# Altium project SolarNode.PrjPCB
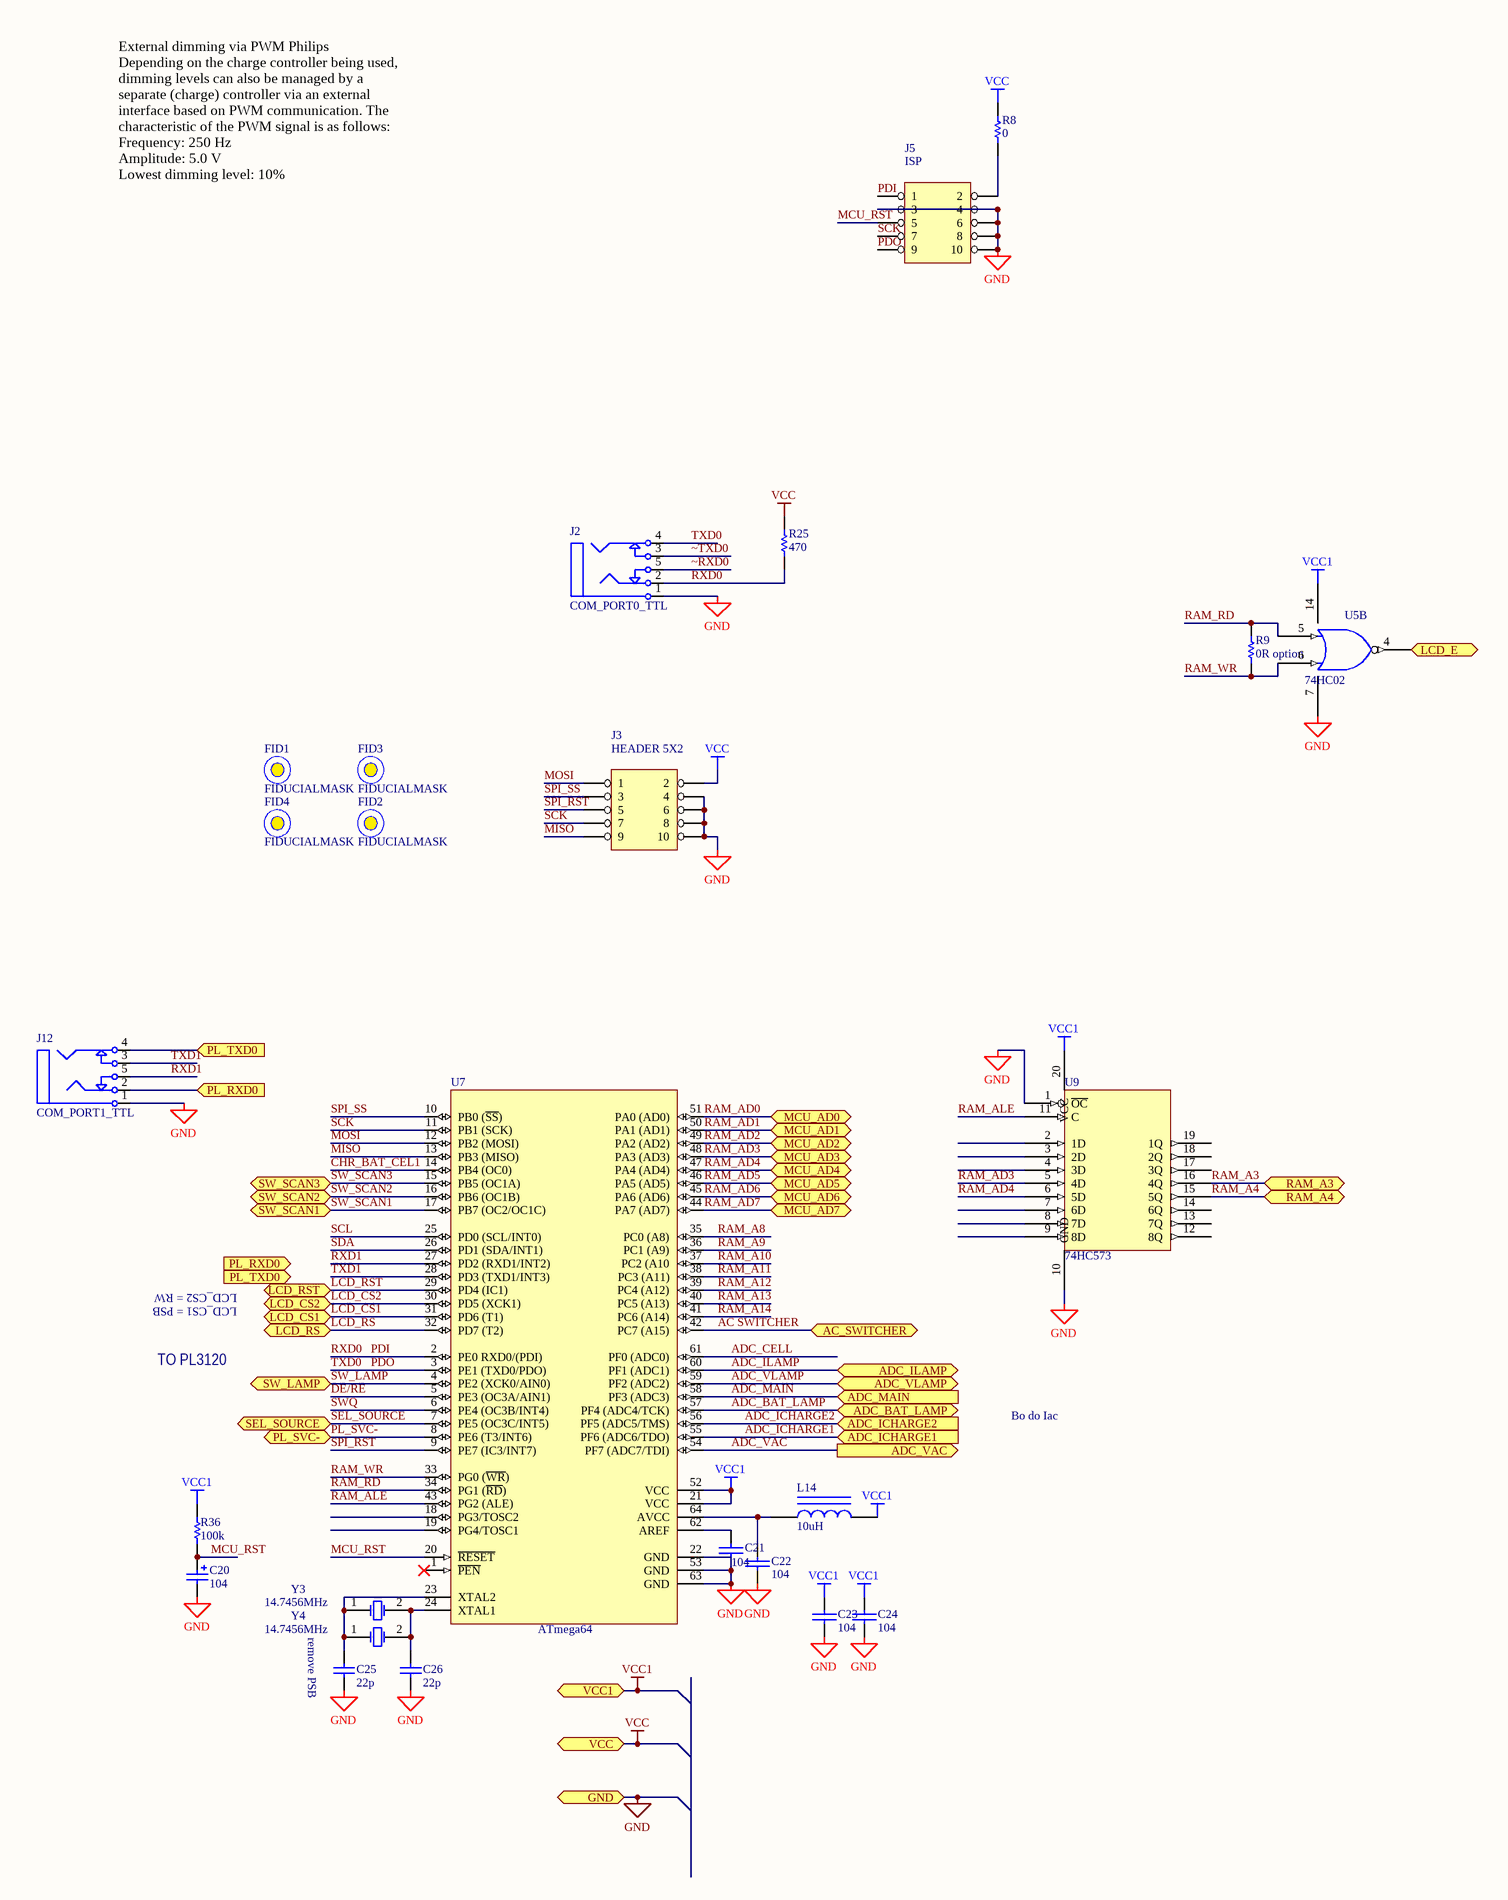
[diagram p0: Mcu.SchDoc, left]
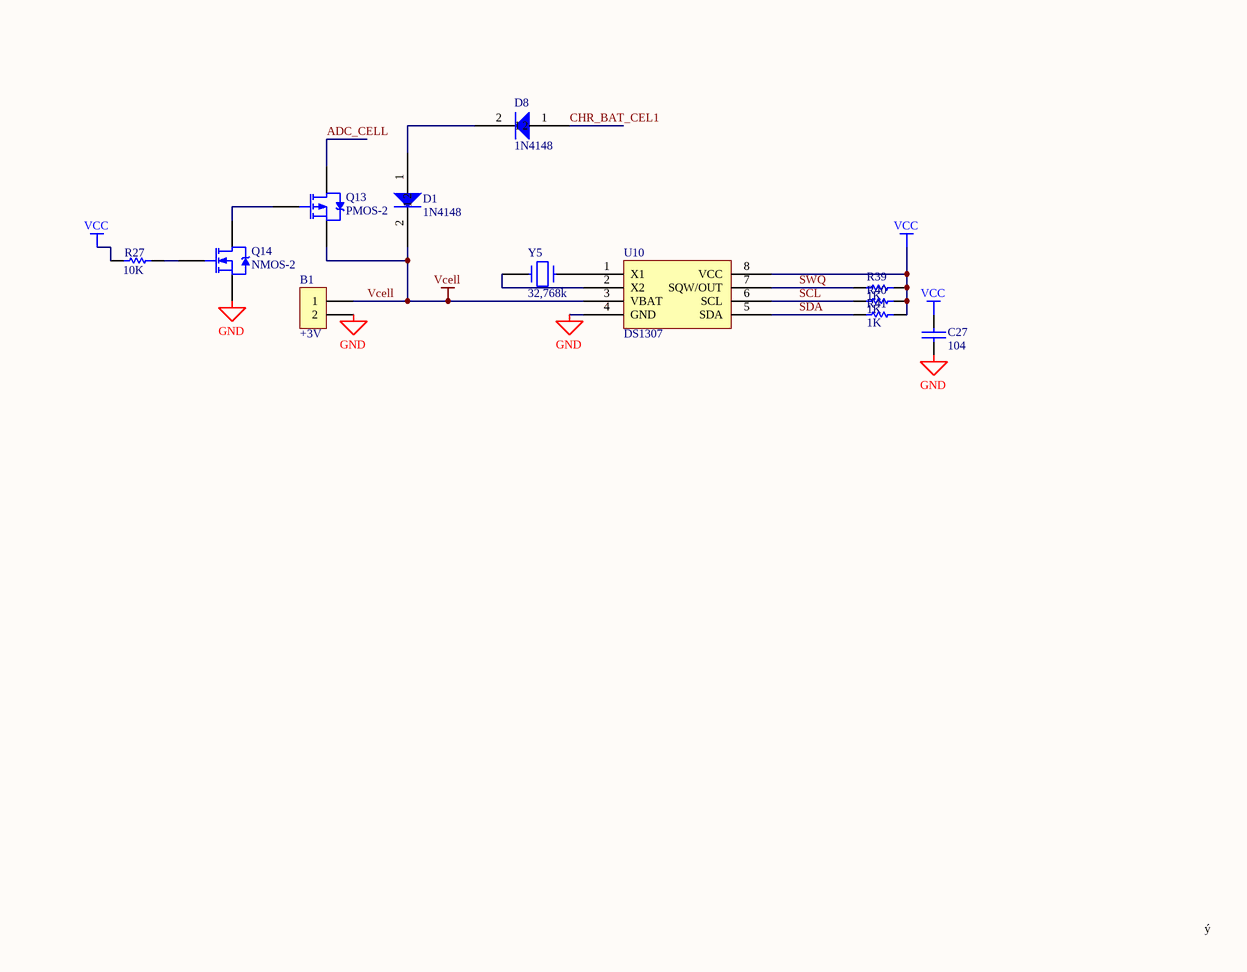
[diagram p1: Mcu.SchDoc, right]
5 sheets, 172 parts. Net scope: flat (ports and power ports of the same name join across sheets).
Board file: SolarNode.PcbDoc
Sheets:
  Mcu.SchDoc
  HUD.SchDoc
  PLmodule.SchDoc
  Actuator.SchDoc
  ACmonitor.SchDoc

## Sheet Mcu.SchDoc
size A2

### Parts
B1  +3V  [NI-MH-3V6]
C20  104  [C6-0805_N]
C21  104  [C6-0805_N]
C22  104  [C6-0805_N]
C23  104  [C6-0805_N]
C24  104  [C6-0805_N]
C25  22p  [C6-0805_N]
C26  22p  [C6-0805_N]
C27  104  [C6-0805_N]
D1  1N4148  [SOD80, LL-34]
D8  1N4148  [SOD80, LL-34]
FID1  FIDUCIALMASK  [FIDUCIALMASK]
FID2  FIDUCIALMASK  [FIDUCIALMASK]
FID3  FIDUCIALMASK  [FIDUCIALMASK]
FID4  FIDUCIALMASK  [FIDUCIALMASK]
J2  COM_PORT0_TTL  [SJ-3515]
J3  HEADER 5X2  [10P_PCB_HEADER_BRD_MNT]
J5  ISP  [10P_PCB_HEADER_BRD_MNT]
J12  COM_PORT1_TTL  [SJ-3515]
L14  10uH  [R6-0805_N]
Q13  PMOS-2  [SOT23-3]
Q14  NMOS-2  [SOT23-3]
R8  0  [JP2]
R9  0R option  [6-0805_N]
R25  470  [6-0805_N]
R27  10K  [6-0805_N]
R36  100k  [6-0805_N]
R39  1K  [6-0805_N]
R40  1K  [6-0805_N]
R41  1K  [6-0805_N]
U5  74HC02  [SOIC127P600X175-14AN]  (part B of 4)
U7  ATmega64  [QFP64-3]
U9  74HC573  [SOIC127P1041-20L]
U10  DS1307  [M08A_N]
Y3  14.7456MHz  [XTAL]
Y4  14.7456MHz  [CRYSTAL_HC49-US-SM]
Y5  32,768k  [R38]

### Ports
AC_SWITCHER, ADC_BAT_LAMP, ADC_ICHARGE1, ADC_ICHARGE2, ADC_ILAMP, ADC_MAIN, ADC_VAC, ADC_VLAMP, GND, LCD_CS1, LCD_CS2, LCD_E, LCD_RS, LCD_RST, MCU_AD0, MCU_AD1, MCU_AD2, MCU_AD3, MCU_AD4, MCU_AD5, MCU_AD6, MCU_AD7, PL_RXD0, PL_SVC-, PL_TXD0, RAM_A3, RAM_A4, SEL_SOURCE, SW_LAMP, SW_SCAN1, SW_SCAN2, SW_SCAN3, VCC, VCC1

### Nets
GND: B1.2 C20.2 C21.2 C22.1 C23.2 C24.2 C25.1 C26.1 C27.2 J2.1 J3.4 J3.6 J3.8 J3.10 J5.3 J5.4 J5.6 J5.8 J5.10 J12.1 Q14.2(S) U5.7(GND) U7.22(GND) U7.53(GND) U7.63(GND) U9.1(~{OC}) U9.10(GND) U10.4(GND) ; port GND
VCC: C27.1 J3.2 R8.1 R25.1 R27.2 R39.2 R40.2 R41.2 U10.8(VCC) ; port VCC
VCC1: C23.1 C24.1 L14.1 R36.2 U5.14(VCC) U7.21(VCC) U7.52(VCC) U9.20(VCC) ; port VCC1
Vcell: B1.1 D1.2 Q13.2(S) U10.3(VBAT)
AC SWITCHER: U7.42(PC7_(A15)) ; port AC_SWITCHER
ADC_BAT_LAMP: U7.57(PF4_(ADC4/TCK)) ; port ADC_BAT_LAMP
ADC_CELL: Q13.3(D) U7.61(PF0_(ADC0))
ADC_ICHARGE1: U7.55(PF6_(ADC6/TDO)) ; port ADC_ICHARGE1
ADC_ICHARGE2: U7.56(PF5_(ADC5/TMS)) ; port ADC_ICHARGE2
ADC_ILAMP: U7.60(PF1_(ADC1)) ; port ADC_ILAMP
ADC_MAIN: U7.58(PF3_(ADC3)) ; port ADC_MAIN
ADC_VAC: U7.54(PF7_(ADC7/TDI)) ; port ADC_VAC
ADC_VLAMP: U7.59(PF2_(ADC2)) ; port ADC_VLAMP
CHR_BAT_CEL1: D8.1 U7.14(PB4_(OC0))
DE/RE: U7.5(PE3_(OC3A/AIN1))
E: U5.4 ; port LCD_E
IO_8: J12.4 ; port PL_TXD0
IO_10: J12.2 ; port PL_RXD0
LCD_CS1: U7.31(PD6_(T1)) ; port LCD_CS1
LCD_CS2: U7.30(PD5_(XCK1)) ; port LCD_CS2
LCD_RS: U7.32(PD7_(T2)) ; port LCD_RS
LCD_RST: U7.29(PD4_(IC1)) ; port LCD_RST
MCU_RST: C20.1 J5.5 R36.1 U7.20(~{RESET})
MISO: J3.9 U7.13(PB3_(MISO))
MOSI: J3.1 U7.12(PB2_(MOSI))
PDI: J2.2 J5.1 R25.2 U7.2(PE0_RXD0/(PDI))  [also labelled RXD0]
PDO: J2.4 J5.9 U7.3(PE1_(TXD0/PDO))  [also labelled TXD0]
PL_SVC-: U7.8(PE6_(T3/INT6)) ; port PL_SVC-
RAM_A3: U9.16(4Q) ; port RAM_A3
RAM_A4: U9.15(5Q) ; port RAM_A4
RAM_A8: U7.35(PC0_(A8))
RAM_A9: U7.36(PC1_(A9))
RAM_A10: U7.37(PC2_(A10)
RAM_A11: U7.38(PC3_(A11))
RAM_A12: U7.39(PC4_(A12))
RAM_A13: U7.40(PC5_(A13))
RAM_A14: U7.41(PC6_(A14))
RAM_AD0: U7.51(PA0_(AD0)) ; port MCU_AD0  [project net DB0]
RAM_AD1: U7.50(PA1_(AD1)) ; port MCU_AD1  [project net DB1]
RAM_AD2: U7.49(PA2_(AD2)) ; port MCU_AD2  [project net DB2]
RAM_AD3: U7.48(PA3_(AD3)) U9.5(4D) ; port MCU_AD3  [project net DB3]
RAM_AD4: U7.47(PA4_(AD4)) U9.6(5D) ; port MCU_AD4  [project net DB4]
RAM_AD5: U7.46(PA5_(AD5)) ; port MCU_AD5  [project net DB5]
RAM_AD6: U7.45(PA6_(AD6)) ; port MCU_AD6  [project net DB6]
RAM_AD7: U7.44(PA7_(AD7)) ; port MCU_AD7  [project net DB7]
RAM_ALE: U7.43(PG2_(ALE)) U9.11(C)
RAM_RD: R9.1 U5.5 U7.34(PG1_(~{RD}))
RAM_WR: R9.2 U5.6 U7.33(PG0_(~{WR}))
RXD1: J12.5 U7.27(PD2_(RXD1/INT2))
SCK: J3.7 J5.7 U7.11(PB1_(SCK))
SCL: R40.1 U7.25(PD0_(SCL/INT0)) U10.6(SCL)
SDA: R41.1 U7.26(PD1_(SDA/INT1)) U10.5(SDA)
SEL_SOURCE: U7.7(PE5_(OC3C/INT5)) ; port SEL_SOURCE
SPI_RST: J3.5 U7.9(PE7_(IC3/INT7))
SPI_SS: J3.3 U7.10(PB0_(~{SS}))
SW_LAMP: U7.4(PE2_(XCK0/AIN0)) ; port SW_LAMP
SW_SCAN1: U7.17(PB7_(OC2/OC1C)) ; port SW_SCAN1
SW_SCAN2: U7.16(PB6_(OC1B)) ; port SW_SCAN2
SW_SCAN3: U7.15(PB5_(OC1A)) ; port SW_SCAN3
SWQ: R39.1 U7.6(PE4_(OC3B/INT4)) U10.7(SQW/OUT)
TXD1: J12.3 U7.28(PD3_(TXD1/INT3))
~RXD0: J2.5
~TXD0: J2.3
NetC21_1: C21.1 U7.62(AREF)
NetC22_2: C22.2 L14.2 U7.64(AVCC)
NetC25_2: C25.2 U7.23(XTAL2) Y3.1(OSC1) Y4.1(OSC1)
NetC26_2: C26.2 U7.24(XTAL1) Y3.2(OSC2) Y4.2(OSC2)
NetD1_1: D1.1 D8.2
NetJ5_2: J5.2 R8.2
NetQ13_1: Q13.1(G) Q14.3(D)
NetQ14_1: Q14.1(G) R27.1
NetU10_1: U10.1(X1) Y5.1
NetU10_2: U10.2(X2) Y5.2

Not connected (* = marked no-connect by the designer): J2 1A 1B 2A 2B 3A 3B 4A 4B 5A 5B; J12 1A 1B 2A 2B 3A 3B 4A 4B 5A 5B; U7 1(~{PEN})* 18(PG3/TOSC2) 19(PG4/TOSC1); U9 2(1D) 3(2D) 4(3D) 7(6D) 8(7D) 9(8D) 12(8Q) 13(7Q) 14(6Q) 17(3Q) 18(2Q) 19(1Q)

### Notes on the sheet
- External dimming via PWM Philips
  Depending on the charge controller being used, dimming levels can also be managed by a
  separate (charge) controller via an external interface based on PWM communication. The
  characteristic of the PWM signal is as follows:
  Frequency: 250 Hz
  Amplitude: 5.0 V
  Lowest dimming level: 10%
- LCD_CS1 = PSB
- LCD_CS2 = RW
- TO PL3120
- Bo do Iac
- (near C25) remove PSB
- ý

### Library data of the parts
B1 = CON2: Ni-Mh 3v6 chargable
C20 = Cap Pol1: Polarized Capacitor (Radial); Published: *; LatestRevisionDate: *; LatestRevisionNote: *; PackageReference: *; Publisher: *; Value: *
C21-C24 C27 = CAP: Capacitor
C25 C26 = Cap: Capacitor; Value: 22 pF; Published: 8-Jun-2000; LatestRevisionDate: 17-Jul-2002; LatestRevisionNote: Re-released for DXP Platform.; PackageReference: RAD-0.3; Publisher: Altium Limited
D1 D8 = DIODE: pin to pad: 1>A 2>K
J2 J12 = Phonejack Stereo SW: 3-Conductor Jack with 2 break contacts (normals) and 2 auxiliary make contacts; Published: 5-Jan-2004; LatestRevisionDate: 17-Dec-2003; LatestRevisionNote: PCB Footprint replaced.; DatasheetDocument: 07-Mar-2000; Publisher: Altium Limited; ComponentLink1Description: Manufacturer Link; ComponentLink1URL: http://domino.kycon.com/internet/Products.html
J5 = HEADER 5X2
L14 = INDUCTOR IRON: 80 Ohm SMD-0805 Chip Ferrite Bead
Q13 = PMOS-2: P Mosfet transistor, input Logic level, Fast switching, 12V - 750mA; Note: Pin 4 not drawn and electrically connected to Pin 2.; Published: 8-Jun-2000; LatestRevisionDate: 17-Jul-2002; LatestRevisionNote: Re-released for DXP Platform.; DatasheetVersion: PD-9.390D; PackageVersion: Feb-1997; PackageReference: TO-220AB; Publisher: Altium Limited; PackageDescription: TO, Thru-Hole, Vertical, Heatsink Mounted; 3 In-Line Leads; Pitch 2.54 mm; ComponentLink1Description: Manufacturer Link; ComponentLink1URL: http://www.irf.com/
Q14 = NMOS-2: N-Channel Power MOSFET; Note: Pin 2 is electrically connected to pin 4.; Published: 8-Jun-2000; LatestRevisionDate: 17-Jul-2002; LatestRevisionNote: Re-released for DXP Platform.; DatasheetVersion: PD-9.814; PackageVersion: Feb-1997; PackageReference: TO-220AB; Publisher: Altium Limited; PackageDescription: TO, Thru-Hole, Vertical, Heatsink Mounted; 3 In-Line Leads; Pitch 2.54 mm; ComponentLink1Description: Manufacturer Link; ComponentLink1URL: http://www.irf.com/
R8 R9 R25 R27 R36 R39-R41 = Res Semi: Semiconductor Resistor; Published: *; LatestRevisionDate: *; LatestRevisionNote: *; PackageReference: *; Publisher: *; Value: *
U5 = 74LS02
U7 = ATmega64-16AC: 8-Bit AVR Microcontroller with 64K Bytes of In-System Programmable Flash Memory; Published: 17-Sep-2003; LatestRevisionDate: 13-Apr-2006; LatestRevisionNote: IPC-7351 Footprint Added.; DatasheetVersion: 2490C-AVR-009/02; PackageVersion: revB, Oct-2001; PackageReference: 64A; Publisher: Altium Limited; PackageDescription: 64-Pin Thin Quad Flat Pack 0.8 mm Pitch; Code_JEDEC: MS-026-AEB; ComponentLink1Description: Manufacturer Link; ComponentLink1URL: http://www.atmel.com; ComponentLink2Description: Datasheet; ComponentLink2URL: http://www.atmel.com/dyn/resources/prod_documents/doc2490.pdf
Y3 Y4 = XTAL: Crystal Oscillator; Published: 8-Jun-2000; LatestRevisionDate: 17-Jul-2002; LatestRevisionNote: Re-released for DXP Platform.; PackageReference: R38; Publisher: Altium Limited
Y5 = CRYSTAL

## Sheet HUD.SchDoc
size A4
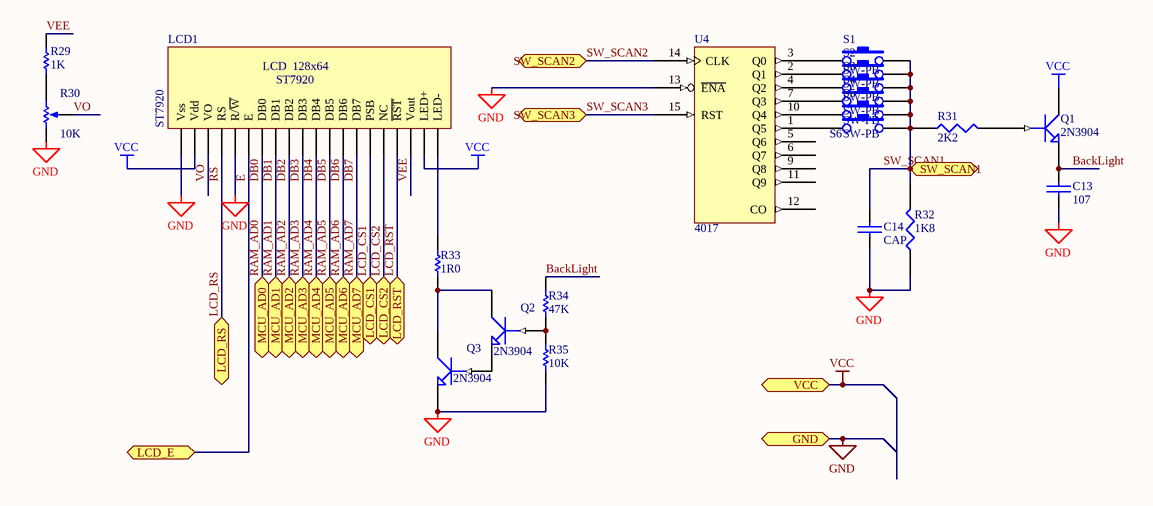
[diagram p2: HUD.SchDoc]

### Parts
C13  107  [SMC_D/WA]
C14  CAP  [6-0805_N]
LCD1  ST7920  [LCD12864B]
Q1  2N3904  [SOT-23]
Q2  2N3904  [SOT-23]
Q3  2N3904  [SOT-23]
R29  1K  [6-0805_N]
R30  10K  [BTXANH]
R31  2K2  [6-0805_N]
R32  1K8  [6-0805_N]
R33  1R0  [6-0805_N]
R34  47K  [6-0805_N]
R35  10K  [6-0805_N]
S1  SW-PB  [CTCHIP_TO]
S2  SW-PB  [CTCHIP_TO]
S3  SW-PB  [CTCHIP_TO]
S4  SW-PB  [CTCHIP_TO]
S5  SW-PB  [CTCHIP_TO]
S6  SW-PB  [CTCHIP_TO]
U4  4017  [SO16]

### Ports
GND, LCD_CS1, LCD_CS2, LCD_E, LCD_RS, LCD_RST, MCU_AD0, MCU_AD1, MCU_AD2, MCU_AD3, MCU_AD4, MCU_AD5, MCU_AD6, MCU_AD7, SW_SCAN1, SW_SCAN2, SW_SCAN3, VCC

### Nets
GND: C13.2 C14.2 LCD1.1(Vss) LCD1.5(R/~{W}) Q3.2(E) R30.1(TOP) R32.1 R35.1 U4.8(GND) U4.13(~{ENA}) ; port GND
VCC: LCD1.2(Vdd) LCD1.19(LED+) Q1.3(C) U4.16(VCC) ; port VCC
BackLight: C13.1 Q1.2(E) R34.2
DB0: LCD1.7(DB0) ; port MCU_AD0  [also labelled RAM_AD0]
DB1: LCD1.8(DB1) ; port MCU_AD1  [also labelled RAM_AD1]
DB2: LCD1.9(DB2) ; port MCU_AD2  [also labelled RAM_AD2]
DB3: LCD1.10(DB3) ; port MCU_AD3  [also labelled RAM_AD3]
DB4: LCD1.11(DB4) ; port MCU_AD4  [also labelled RAM_AD4]
DB5: LCD1.12(DB5) ; port MCU_AD5  [also labelled RAM_AD5]
DB6: LCD1.13(DB6) ; port MCU_AD6  [also labelled RAM_AD6]
DB7: LCD1.14(DB7) ; port MCU_AD7  [also labelled RAM_AD7]
E: LCD1.6(E) ; port LCD_E
LCD_CS1: LCD1.15(PSB) ; port LCD_CS1
LCD_CS2: LCD1.16(NC) ; port LCD_CS2
LCD_RS: LCD1.4(RS) ; port LCD_RS  [also labelled RS]
LCD_RST: LCD1.17(~{RST}) ; port LCD_RST
SW_SCAN1: C14.1 R31.1 R32.2 S1.2 S2.2 S3.2 S4.2 S5.2 S6.2 ; port SW_SCAN1
SW_SCAN2: U4.14(CLK) ; port SW_SCAN2
SW_SCAN3: U4.15(RST) ; port SW_SCAN3
VEE: LCD1.18(Vout) R29.2
VO: LCD1.3(VO) R30.2(TAP)
NetLCD1_20: LCD1.20(LED-) R33.2
NetQ1_1: Q1.1(B) R31.2
NetQ2_1: Q2.1(B) R34.1 R35.2
NetQ2_2: Q2.2(E) Q3.1(B)
NetQ2_3: Q2.3(C) Q3.3(C) R33.1
NetR29_1: R29.1 R30.3(BOT)
NetS1_1: S1.1 U4.3(Q0)
NetS2_1: S2.1 U4.2(Q1)
NetS3_1: S3.1 U4.4(Q2)
NetS4_1: S4.1 U4.7(Q3)
NetS5_1: S5.1 U4.10(Q4)
NetS6_1: S6.1 U4.1(Q5)

Not connected (* = marked no-connect by the designer): U4 5(Q6) 6(Q7) 9(Q8) 11(Q9) 12(CO)

### Notes on the sheet
- (in symbol ST7920) LCD  128x64

### Library data of the parts
C13 C14 = CAP: Capacitor
LCD1 = ST7920: ST7920 LCD128X64
Q1-Q3 = NPN1: NPN Transistor
R29 = Res Semi: Semiconductor Resistor; Value: 470R; Published: 8-Jun-2000; LatestRevisionDate: 17-Jul-2002; LatestRevisionNote: Re-released for DXP Platform.; PackageReference: AXIAL-0.5; Publisher: Altium Limited
R30 = RPot: Potentiometer; Published: *; LatestRevisionDate: *; LatestRevisionNote: *; PackageReference: *; Publisher: *; Sim Note: *; Set Position: *; Value: *
R31 R32 = RES1
R33 = Res Semi: Semiconductor Resistor; Value: 10R; Published: 8-Jun-2000; LatestRevisionDate: 17-Jul-2002; LatestRevisionNote: Re-released for DXP Platform.; PackageReference: AXIAL-0.5; Publisher: Altium Limited
R34 = Res Semi: Semiconductor Resistor; Value: 2K2; Published: 8-Jun-2000; LatestRevisionDate: 17-Jul-2002; LatestRevisionNote: Re-released for DXP Platform.; PackageReference: AXIAL-0.5; Publisher: Altium Limited
R35 = Res Semi: Semiconductor Resistor; Published: 8-Jun-2000; LatestRevisionDate: 17-Jul-2002; LatestRevisionNote: Re-released for DXP Platform.; PackageReference: AXIAL-0.5; Publisher: Altium Limited; Value: 10K

## Sheet PLmodule.SchDoc
size A4
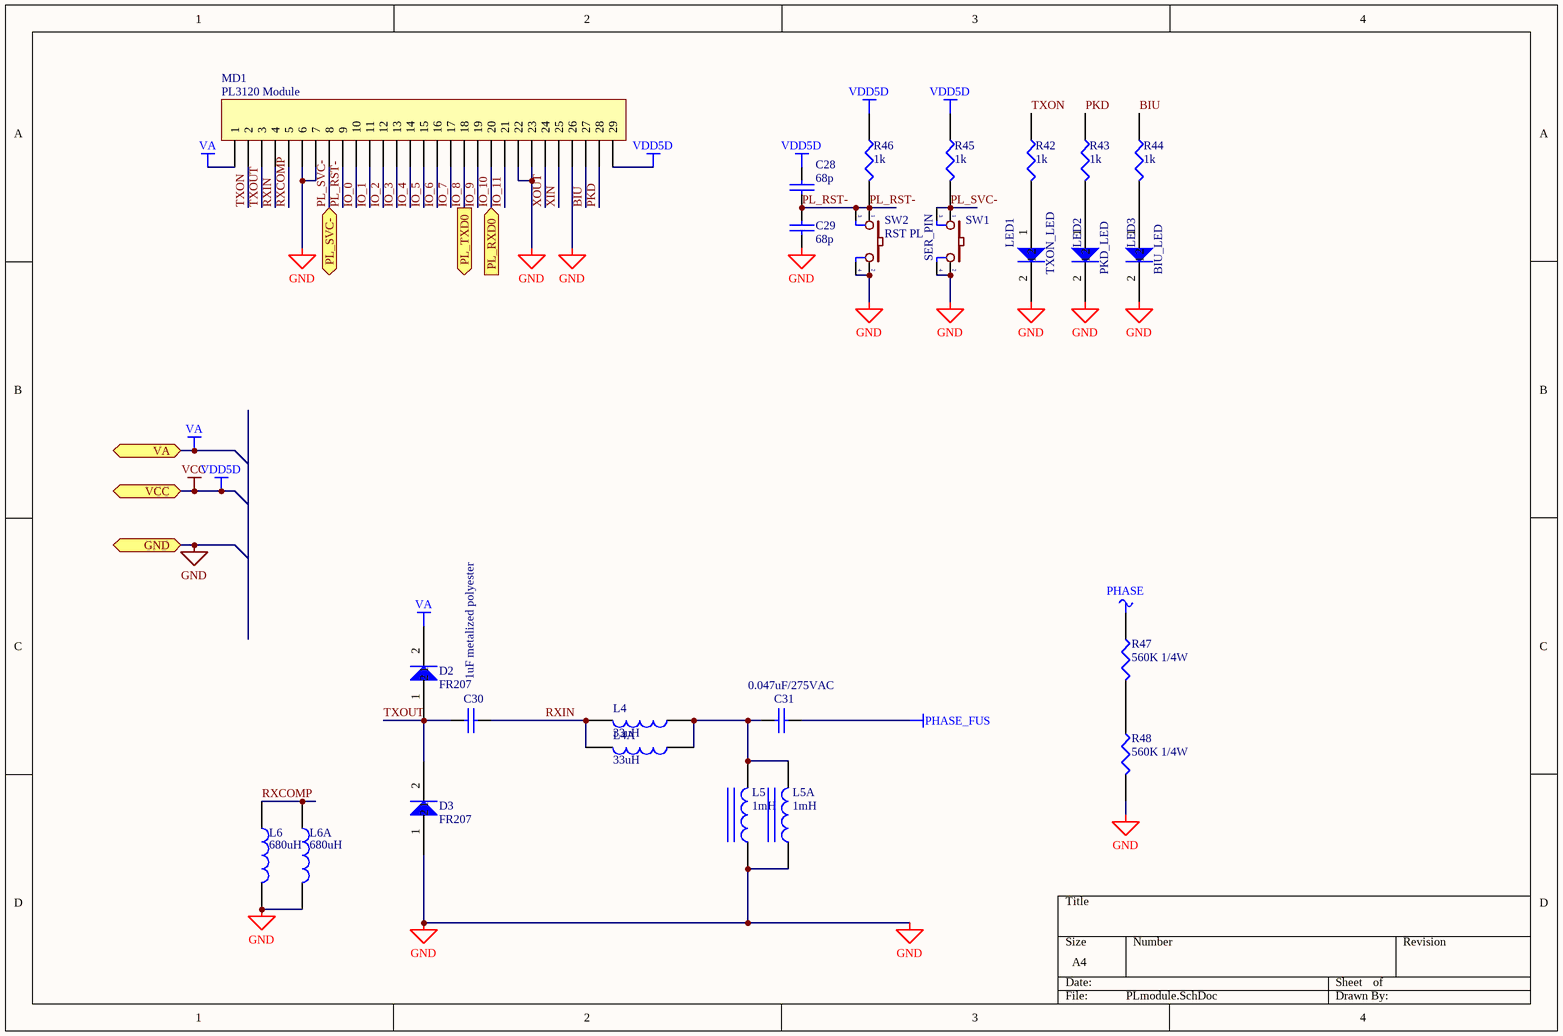
[diagram p3: PLmodule.SchDoc]

### Parts
C28  68p  [C6-0805_N]
C29  68p  [C6-0805_N]
C30  1uF metalized polyester  [CSIP3]
C31  0.047uF/275VAC  [100n400v]
D2  FR207  [DO-214AB]
D3  FR207  [DO-214AB]
L4  33uH  [6D28]
L4A  33uH  [Axial-0.3]
L5  1mH  [6-0805_N]
L5A  1mH  [AXIAL-0.3]
L6  680uH  [6-0805_N]
L6A  680uH  [AXIAL-0.3]
LED1  TXON_LED  [led3mm]
LED2  PKD_LED  [led3mm]
LED3  BIU_LED  [led3mm]
MD1  PL3120 Module  [ECHELONMODULE]
R42  1k  [6-0805_N]
R43  1k  [6-0805_N]
R44  1k  [6-0805_N]
R45  1k  [6-0805_N]
R46  1k  [6-0805_N]
R47  560K 1/4W  [R3216[1206]]
R48  560K 1/4W  [R3216[1206]]
SW1  SER_PIN  [SW-4P-S]
SW2  RST PL  [SW-4P-S]

### Ports
GND, PL_RXD0, PL_SVC-, PL_TXD0, VA, VCC

### Nets
GND: C29.2 D3.1 L5.2 L5A.2 L6.2 L6A.2 LED1.2 LED2.2 LED3.2 MD1.6 MD1.7 MD1.22 MD1.23 MD1.26 R48.1 SW1.2 SW1.4 SW2.2 SW2.4 ; port GND
PHASE: R47.2
PHASE_FUS: C31.1
VA: D2.2 MD1.1 ; port VA
VCC: C28.2 MD1.29 R45.1 R46.1 ; port VCC  [also labelled VDD5D]
BIU: MD1.27 R44.1
IO_0: MD1.10
IO_1: MD1.11
IO_2: MD1.12
IO_3: MD1.13
IO_4: MD1.14
IO_5: MD1.15
IO_6: MD1.16
IO_7: MD1.17
IO_8: MD1.18 ; port PL_TXD0
IO_9: MD1.19
IO_10: MD1.20 ; port PL_RXD0
IO_11: MD1.21
PKD: MD1.28 R43.1
PL_RST-: C28.1 C29.1 MD1.9 R46.2 SW2.1 SW2.3
PL_SVC-: MD1.8 R45.2 SW1.1 SW1.3 ; port PL_SVC-
RXCOMP: L6.1 L6A.1 MD1.5
RXIN: C30.2 L4.1 L4A.1 MD1.4
TXON: MD1.2 R42.1
TXOUT: C30.1 D2.1 D3.2 MD1.3
XIN: MD1.25
XOUT: MD1.24
NetC31_2: C31.2 L4.2 L4A.2 L5.1 L5A.1
NetLED1_1: LED1.1 R42.2
NetLED2_1: LED2.1 R43.2
NetLED3_1: LED3.1 R44.2
NetR47_1: R47.1 R48.2

### Library data of the parts
C28-C30 = CAP: Capacitor
C31 = CAP: X2 0.047uF/275VAC
D2 D3 = DIODE: pin to pad: 1>A 2>K
L4 = INDUCTOR: 0805 inductor
L4A = INDUCTOR: Axial inductor
L5 L5A = INDUCTOR IRON
L6 L6A = INDUCTOR
LED1-LED3 = DIODE
MD1 = CON29: Connector
R42-R48 = RES1
SW1 SW2 = SW4-1: Switch button 4 pin; pin to pad: 3>4 4>3; Value: SW chip 4 pin

## Sheet Actuator.SchDoc
size A3
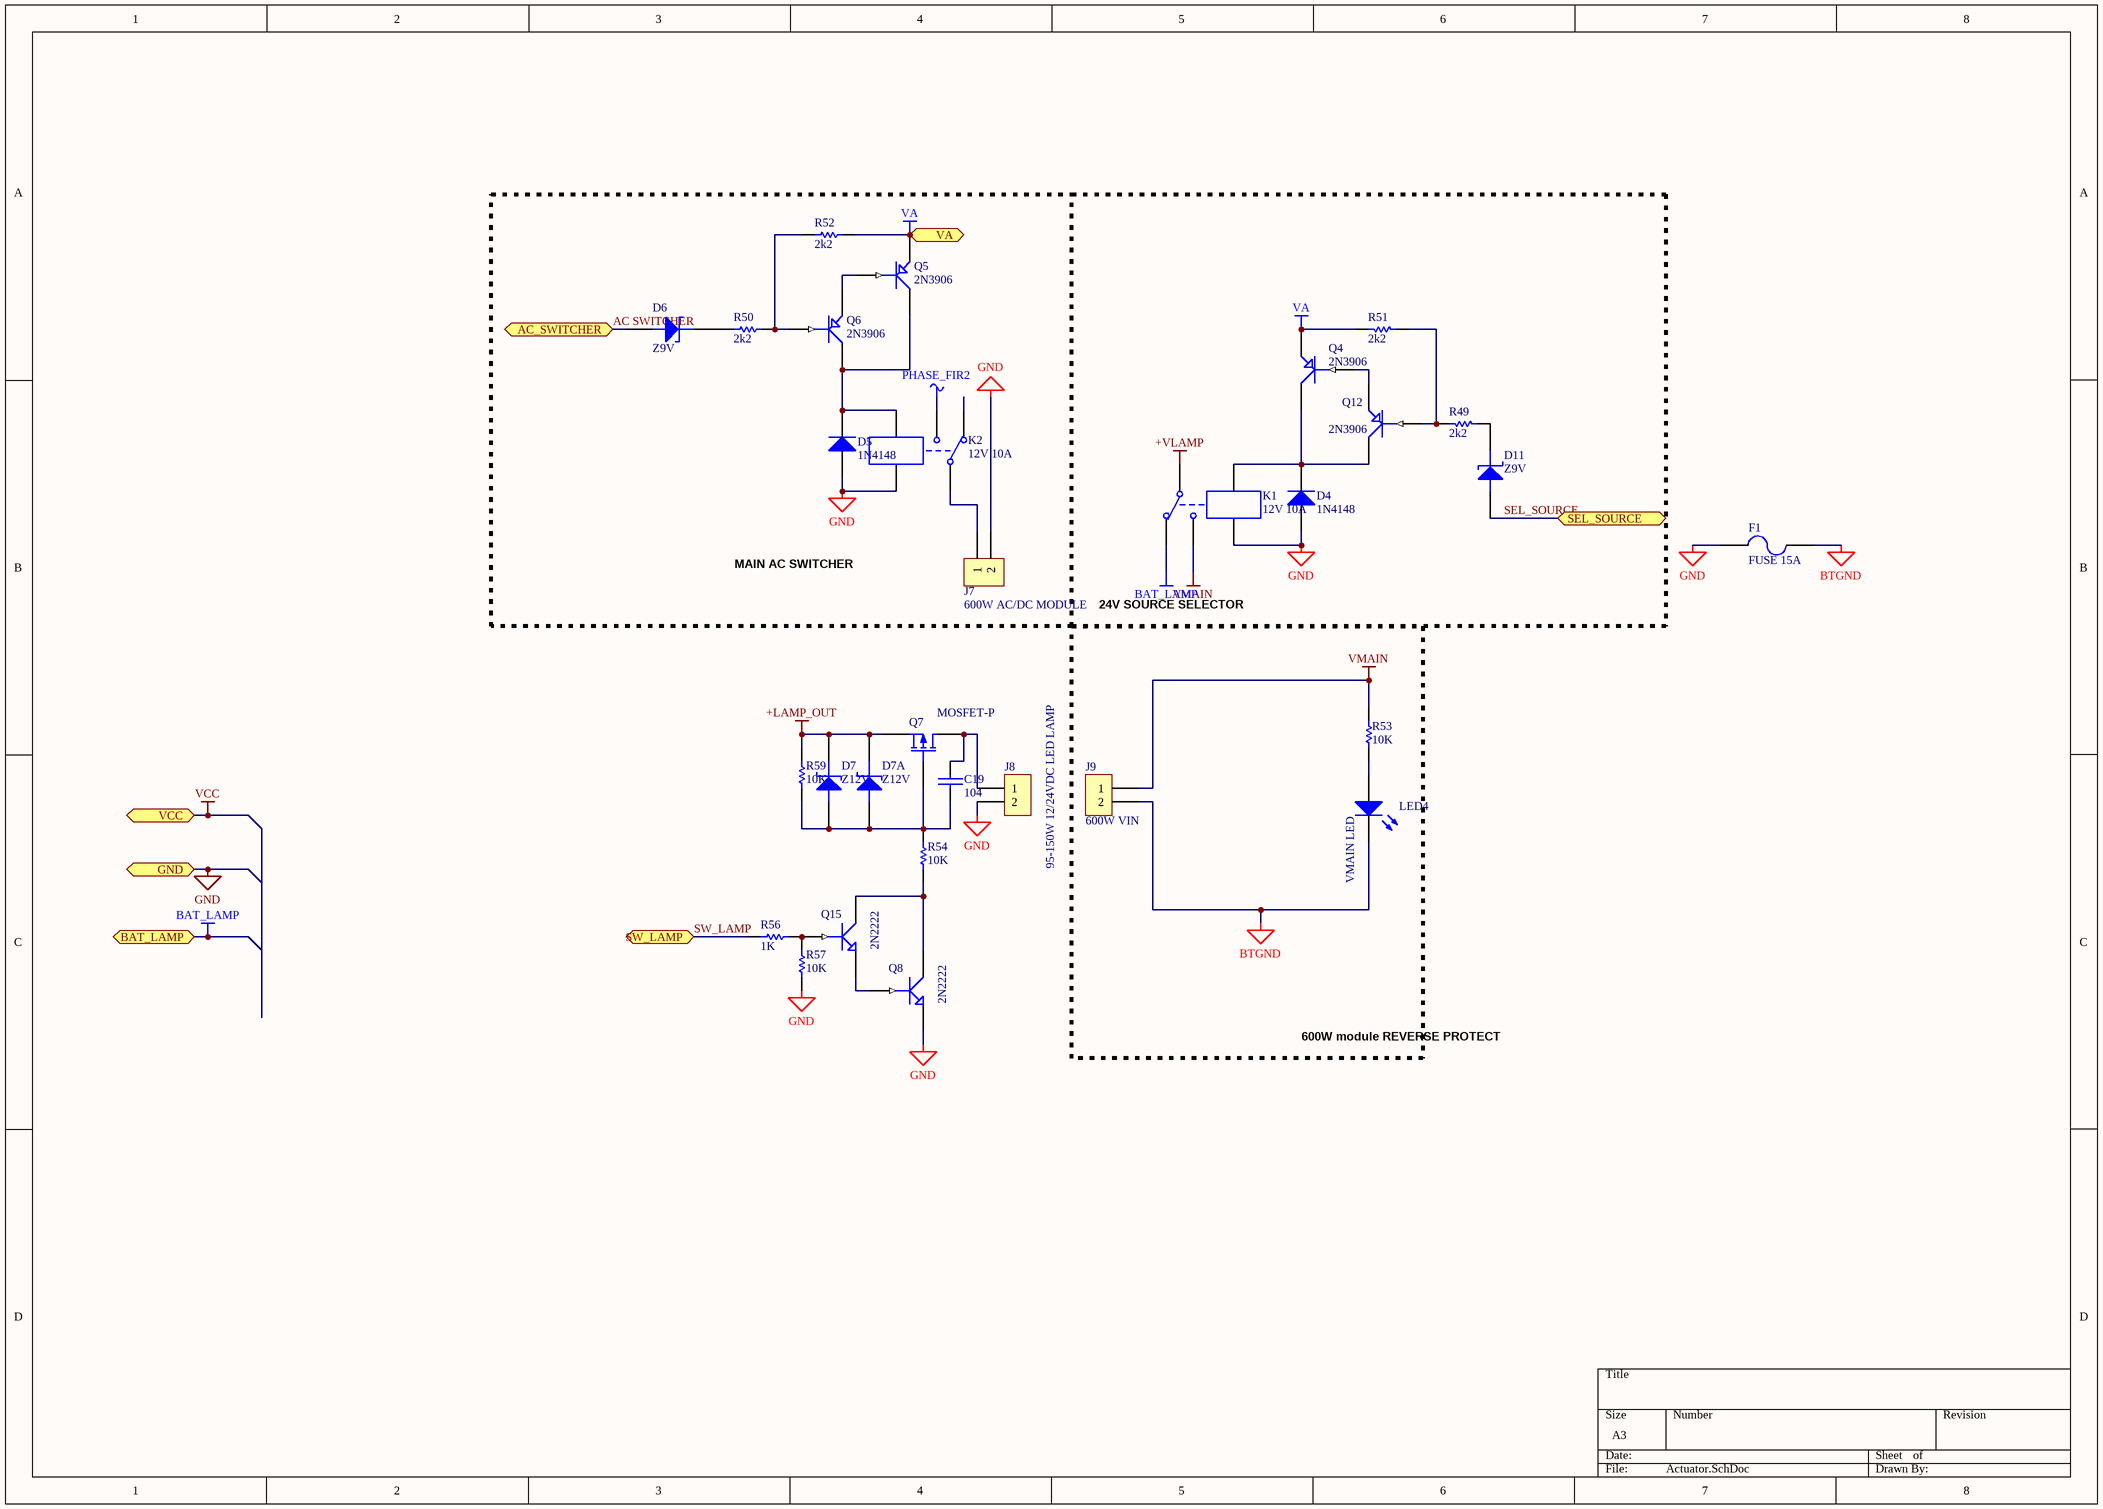
[diagram p4: Actuator.SchDoc]

### Parts
C19  104  [C6-0805_N]
D4  1N4148  [SOD80, LL-34]
D5  1N4148  [SOD80, LL-34]
D6  Z9V  [SOD80, LL-34]
D7  Z12V  [DO-35]
D7A  Z12V  [SOD80, LL-34]
D11  Z9V  [SOD80, LL-34]
F1  FUSE 15A  [FUSE2]
J7  600W AC/DC MODULE  [TERMINAL2]
J8  95-150W 12/24VDC LED LAMP  [TERMINAL2]
J9  600W VIN  [TERMINAL2]
K1  12V 10A  [RELAYVUONG]
K2  12V 10A  [RELAYVUONG]
LED4  VMAIN LED  [led3mm]
Q4  2N3906  [SOT23-3]
Q5  2N3906  [SOT23-3]
Q6  2N3906  [SOT23-3]
Q7  MOSFET-P  [D2PAK-3]
Q8  2N2222  [SOT23-3]
Q12  2N3906  [SOT23-3]
Q15  2N2222  [SOT23-3]
R49  2k2  [6-0805_N]
R50  2k2  [6-0805_N]
R51  2k2  [6-0805_N]
R52  2k2  [6-0805_N]
R53  10K  [6-0805_N]
R54  10K  [6-0805_N]
R56  1K  [6-0805_N]
R57  10K  [6-0805_N]
R59  10K  [6-0805_N]

### Blocks framed on the sheet
24V SOURCE SELECTOR: D4 D11 K1 Q4 Q12 R49 R51

### Ports
AC_SWITCHER, BAT_LAMP, GND, SEL_SOURCE, SW_LAMP, VA, VCC

### Nets
+LAMP_OUT: D7.2(K) D7A.2(K) Q7.3(S) R59.2
+VLAMP: K1.1
BAT_LAMP: K1.2 ; port BAT_LAMP
BTGND: F1.2 J9.2 LED4.2(K)
GND: D4.1(A) D5.1(A) F1.1 J7.2 J8.2 K1.5 K2.4 Q8.2(E) R57.1 ; port GND
PHASE_FIR2: K2.3
VA: Q4.2(E) Q5.2(E) R51.2 R52.2 ; port VA
VMAIN: J9.1 K1.3 R53.2
AC SWITCHER: D6.1(A) ; port AC_SWITCHER
SEL_SOURCE: D11.1(A) ; port SEL_SOURCE
SW_LAMP: R56.1 ; port SW_LAMP
NetC19_1: C19.1 J8.1 Q7.2(D)
NetC19_2: C19.2 D7.1(A) D7A.1(A) Q7.1(G) R54.2 R59.1
NetD4_2: D4.2(K) K1.4 Q4.3(C) Q12.3(C)
NetD5_2: D5.2(K) K2.5 Q5.3(C) Q6.3(C)
NetD6_2: D6.2(K) R50.1
NetD11_2: D11.2(K) R49.1
NetJ7_1: J7.1 K2.1
NetLED4_1: LED4.1(A) R53.1
NetQ4_1: Q4.1(B) Q12.2(E)
NetQ5_1: Q5.1(B) Q6.2(E)
NetQ6_1: Q6.1(B) R50.2 R52.1
NetQ8_1: Q8.1(B) Q15.2(E)
NetQ8_3: Q8.3(C) Q15.3(C) R54.1
NetQ12_1: Q12.1(B) R49.2 R51.1
NetQ15_1: Q15.1(B) R56.2 R57.2

Not connected (* = marked no-connect by the designer): K2 2

### Notes on the sheet
- MAIN AC SWITCHER
- 600W module REVERSE PROTECT

### Library data of the parts
C19 = CAP: Capacitor
D4 D5 = Diode 1N4007: 1 Amp General Purpose Rectifier; pin to pad: 1>A 2>K; Published: 8-Jun-2000; LatestRevisionDate: 17-Jul-2002; LatestRevisionNote: Re-released for DXP Platform.; DatasheetDocument: 1998; PackageDocument: Aug-1999; PackageReference: DO-41; Publisher: Altium Limited; Code_JEDEC: DO-204-AL; ComponentLink1Description: Manufacturer Link; ComponentLink1URL: http://www.fairchildsemi.com/; ComponentLink2Description: Datasheet; ComponentLink2URL: http://www.fairchildsemi.com/ds/1N%2F1N4001.pdf
D6 D7A D11 = ZENER2: Zener Diode; pin to pad: 1>A 2>K
D7 = ZENER2: Zener Diode
F1 = FUSE2: Fuse
J7-J9 = CON2: Connector
K1 K2 = Relay-SPDT: G5LA-10A/250VAC / SRC-12VDC-SL-C; Published: 24-Mar-1999; LatestRevisionDate: 17-Jul-2002; LatestRevisionNote: Re-released for DXP Platform.; PackageReference: MODULE5B; Publisher: Altium Limited
LED4 = LED3: Typical BLUE SiC LED; Published: 8-Jun-2000; LatestRevisionDate: 17-Dec-2003; LatestRevisionNote: PCB Footprint replaced.; DatasheetVersion: 16-Apr-2002; PackageVersion: 16-Apr-2002; PackageReference: 3.5X2.8X1.9; Publisher: Altium Limited; PackageDescription: SM LED; 2 C-Bend Leads; Body 3.5 x 2.8 x 1.9 mm, inc leads (LxWxH typ)
Q4-Q6 Q12 = PNP1: PNP Transistor
Q7 = MOSFET-P: P-Channel MOSFET; pin to pad: 2>4; Published: 8-Jun-2000; LatestRevisionDate: 17-Jul-2002; LatestRevisionNote: Re-released for DXP Platform.; PackageVersion: 1995/1996; PackageReference: E3; Publisher: Altium Limited; PackageDescription: TO, Flat Index; 3 In-Line, Axial Leads; Body Dia. 4.6mm; Lead Dia. 0.5 mm (max)
Q8 Q15 = NPN1: NPN Transistor
R49 R50 R53 R57 = Res Semi: Semiconductor Resistor
  R49 R50: Published: 8-Jun-2000; LatestRevisionDate: 17-Jul-2002; LatestRevisionNote: Re-released for DXP Platform.; PackageReference: AXIAL-0.5; Publisher: Altium Limited; Value: 2K2
  R53: Published: *; LatestRevisionDate: *; LatestRevisionNote: *; PackageReference: *; Publisher: *; Value: *
  R57: Published: 8-Jun-2000; LatestRevisionDate: 17-Jul-2002; LatestRevisionNote: Re-released for DXP Platform.; PackageReference: AXIAL-0.5; Publisher: Altium Limited; Value: 10K
R51 R52 = Res Semi: Semiconductor Resistor; Value: 10K; Published: 8-Jun-2000; LatestRevisionDate: 17-Jul-2002; LatestRevisionNote: Re-released for DXP Platform.; PackageReference: AXIAL-0.5; Publisher: Altium Limited
R54 R56 R59 = Res Semi: Semiconductor Resistor; Value: 2K2; Published: 8-Jun-2000; LatestRevisionDate: 17-Jul-2002; LatestRevisionNote: Re-released for DXP Platform.; PackageReference: AXIAL-0.5; Publisher: Altium Limited

## Sheet ACmonitor.SchDoc
size A3
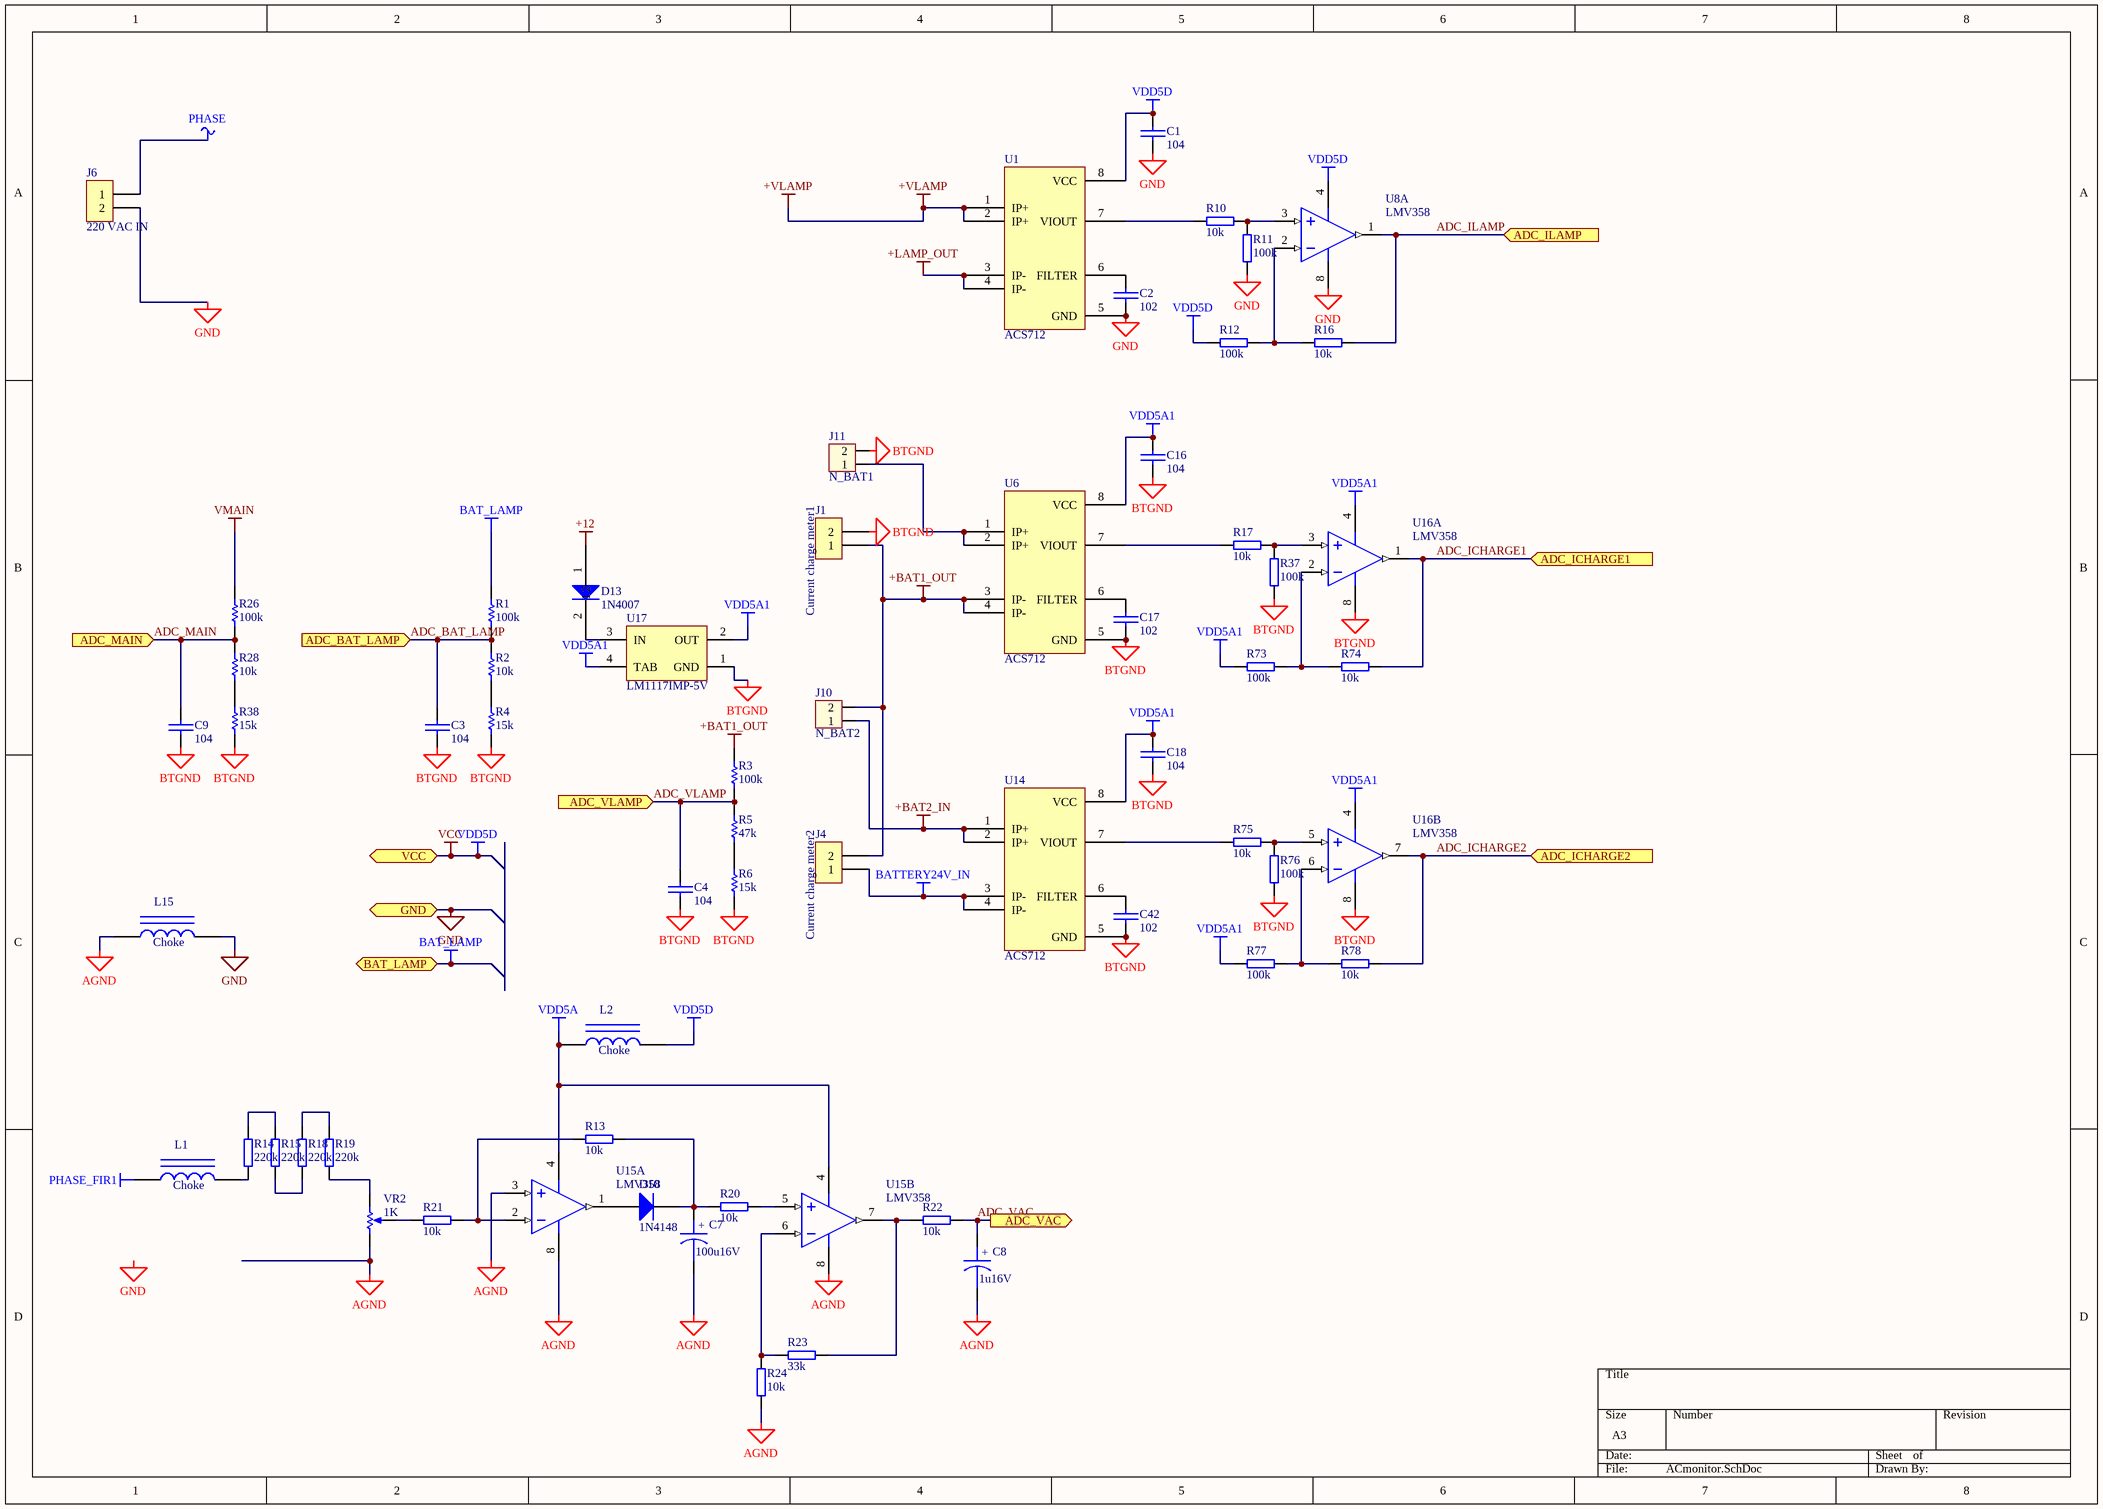
[diagram p5: ACmonitor.SchDoc]

### Parts
C1  104  [C6-0805_N]
C2  102  [C6-0805_N]
C3  104  [C6-0805_N]
C4  104  [C6-0805_N]
C7  100u16V  [CAPMP7343X310N]
C8  1u16V  [CAPMP3528X210N]
C9  104  [C6-0805_N]
C16  104  [C6-0805_N]
C17  102  [C6-0805_N]
C18  104  [C6-0805_N]
C42  102  [C6-0805_N]
D10  1N4148  [SOD80, LL-34]
D13  1N4007  [DO-214AA]
J1  Current charge meter1  [TERMINAL2]
J4  Current charge meter2  [TERMINAL2]
J6  220 VAC IN  [TERMINAL2]
J10  N_BAT2  [TERMINAL2]
J11  N_BAT1  [TERMINAL2]
L1  Choke  [R6-0805_N]
L2  Choke  [R6-0805_N]
L15  Choke  [R6-0805_N]
R1  100k  [6-0805_N]
R2  10k  [6-0805_N]
R3  100k  [6-0805_N]
R4  15k  [6-0805_N]
R5  47k  [6-0805_N]
R6  15k  [6-0805_N]
R10  10k  [6-0805_N]
R11  100k  [6-0805_N]
R12  100k  [6-0805_N]
R13  10k  [6-0805_N]
R14  220k  [R3216[1206]]
R15  220k  [R3216[1206]]
R16  10k  [6-0805_N]
R17  10k  [6-0805_N]
R18  220k  [R3216[1206]]
R19  220k  [R3216[1206]]
R20  10k  [6-0805_N]
R21  10k  [6-0805_N]
R22  10k  [6-0805_N]
R23  33k  [6-0805_N]
R24  10k  [6-0805_N]
R26  100k  [6-0805_N]
R28  10k  [6-0805_N]
R37  100k  [6-0805_N]
R38  15k  [6-0805_N]
R73  100k  [6-0805_N]
R74  10k  [6-0805_N]
R75  10k  [6-0805_N]
R76  100k  [6-0805_N]
R77  100k  [6-0805_N]
R78  10k  [6-0805_N]
U1  ACS712  [M08A_N]
U6  ACS712  [M08A_N]
U8  LMV358  [M08A_N]  (part A of 2)
U14  ACS712  [M08A_N]
U15  LMV358  [M08A_N]  (parts A,B of 2)
U16  LMV358  [M08A_N]  (parts A,B of 2)
U17  LM1117IMP-5V  [MP04A_N]
VR2  1K  [BTXANH]

### Ports
ADC_BAT_LAMP, ADC_ICHARGE1, ADC_ICHARGE2, ADC_ILAMP, ADC_MAIN, ADC_VAC, ADC_VLAMP, BAT_LAMP, GND, VCC

### Nets
+12: D13.1
+BAT1_OUT: J1.1 J4.2 J10.2 R3.1 U6.3(IP-) U6.4(IP-)
+BAT2_IN: J10.1 U14.1(IP+) U14.2(IP+)
+LAMP_OUT: U1.3(IP-) U1.4(IP-)
+VLAMP: U1.1(IP+) U1.2(IP+)
AGND: C7.2 C8.2 L15.1 R24.2 U15.3(INA+) U15.8(V+) VR2.1(TOP)
BAT_LAMP: R1.1 ; port BAT_LAMP
BATTERY24V_IN: J4.1 U14.3(IP-) U14.4(IP-)
BTGND: C3.2 C4.2 C9.2 C16.2 C17.2 C18.2 C42.2 J1.2 J11.2 R4.2 R6.2 R37.2 R38.2 R76.2 U6.5(GND) U14.5(GND) U16.8(V+) U17.1(GND)
GND: C1.2 C2.2 J6.2 L15.2 R11.2 U1.5(GND) U8.8(V+) ; port GND
PHASE: J6.1
PHASE_FIR1: L1.1
VCC: C1.1 L2.2 R12.2 U1.8(VCC) U8.4(GND) ; port VCC  [also labelled VDD5D]
VDD5A: L2.1 U15.4(GND)
VDD5A1: C16.1 C18.1 R73.2 R77.2 U6.8(VCC) U14.8(VCC) U16.4(GND) U17.2(OUT) U17.4(TAB)
VMAIN: R26.1
ADC_BAT_LAMP: C3.1 R1.2 R2.1 ; port ADC_BAT_LAMP
ADC_ICHARGE1: R74.2 U16.1(OUTA) ; port ADC_ICHARGE1
ADC_ICHARGE2: R78.2 U16.7(OUTB) ; port ADC_ICHARGE2
ADC_ILAMP: R16.2 U8.1(OUTA) ; port ADC_ILAMP
ADC_MAIN: C9.1 R26.2 R28.1 ; port ADC_MAIN
ADC_VAC: C8.1 R22.1 ; port ADC_VAC
ADC_VLAMP: C4.1 R3.2 R5.1 ; port ADC_VLAMP
NetC2_1: C2.1 U1.6(FILTER)
NetC7_1: C7.1 D10.2(K) R13.1 R20.2
NetC17_1: C17.1 U6.6(FILTER)
NetC42_1: C42.1 U14.6(FILTER)
NetD10_1: D10.1(A) U15.1(OUTA)
NetD13_2: D13.2 U17.3(IN)
NetJ11_1: J11.1 U6.1(IP+) U6.2(IP+)
NetL1_2: L1.2 R14.2
NetR2_2: R2.2 R4.1
NetR5_2: R5.2 R6.1
NetR10_1: R10.1 R11.1 U8.3(INA+)
NetR10_2: R10.2 U1.7(VIOUT)
NetR12_1: R12.1 R16.1 U8.2(INA-)
NetR13_2: R13.2 R21.1 U15.2(INA-)
NetR14_1: R14.1 R15.1
NetR15_2: R15.2 R18.2
NetR17_1: R17.1 R37.1 U16.3(INA+)
NetR17_2: R17.2 U6.7(VIOUT)
NetR18_1: R18.1 R19.1
NetR19_2: R19.2 VR2.3(BOT)
NetR20_1: R20.1 U15.5(INB+)
NetR21_2: R21.2 VR2.2(TAP)
NetR22_2: R22.2 R23.1 U15.7(OUTB)
NetR23_2: R23.2 R24.1 U15.6(INB-)
NetR28_2: R28.2 R38.1
NetR73_1: R73.1 R74.1 U16.2(INA-)
NetR75_1: R75.1 R76.1 U16.5(INB+)
NetR75_2: R75.2 U14.7(VIOUT)
NetR77_1: R77.1 R78.1 U16.6(INB-)

### Notes on the sheet
- Labels drawn without touching a wire or pin: GND
- (in symbol CAPACITOR POL) +

### Library data of the parts
C1-C4 C9 C16-C18 C42 = CAP: Capacitor
C7 C8 = CAPACITOR POL: Capacitor
D10 = Diode 1N4007: 1 Amp General Purpose Rectifier; pin to pad: 1>A 2>K; Published: 8-Jun-2000; LatestRevisionDate: 17-Jul-2002; LatestRevisionNote: Re-released for DXP Platform.; DatasheetDocument: 1998; PackageDocument: Aug-1999; PackageReference: DO-41; Publisher: Altium Limited; Code_JEDEC: DO-204-AL; ComponentLink1Description: Manufacturer Link; ComponentLink1URL: http://www.fairchildsemi.com/; ComponentLink2Description: Datasheet; ComponentLink2URL: http://www.fairchildsemi.com/ds/1N%2F1N4001.pdf
D13 = DIODE: pin to pad: 1>A 2>K
J1 J4 J6 = CON2: Connector
J10 J11 = Con2: Connector 2; Value: Connector 2
L1 L2 L15 = INDUCTOR IRON
R1-R6 R26 R28 R38 = Res Semi: Semiconductor Resistor; Published: *; LatestRevisionDate: *; LatestRevisionNote: *; PackageReference: *; Publisher: *; Value: *
R10-R24 R37 R73-R78 = RES2
U8 U15 U16 = LM358AM: Low Power Dual Operational Amplifier, 8-pin Narrow SOIC; Manufacturer: National Semiconductor; PackageTopMarking: NSZXTT*LM*358AM; PowerWise: N; CompType: Amplifiers; Published: 4-Dec-2008; LatestRevisionDate: 13-Jan-2009; LatestRevisionNote: Sim Model Added.; DatasheetVersion: Oct-2005; PackageVersion: revM, May-2009; PackageReference: M08A; Publisher: Altium Limited; PackageDescription: SOIC Narrow, 4.9 x 3.9 x 1.45mm, 8 Lead, 1.27mm Pitch; Supplier 1: Farnell; Supplier Part Number 1: 9486801; PartNumber: LM358AM; RoHS: N; PinCount: 8; Code_JEDEC: MS-012-AA; Code_IPC: SOIC127P600-8; ComponentLink1Description: LM358 Datasheet; ComponentLink1URL: http://www.national.com/ds/LM/LM358.pdf; ComponentLink2Description: LM358 Web Page; ComponentLink2URL: http://www.national.com/pf/LM/LM358.html; ComponentLink3Description: M08A Package Page; ComponentLink3URL: http://www.national.com/packaging/folders/m08a.html
U17 = LM1117IMP-3.3: 800mA Low-Dropout Linear Regulator, 4-pin SOT-223; Manufacturer: National Semiconductor; PackageTopMarking: XYTT*N05B; PowerWise: N; CompType: LDO IC; Published: 4-Dec-2008; DatasheetVersion: Apr-2006; PackageVersion: revB, Apr-2003; PackageReference: MP04A; Publisher: Altium Limited; PackageDescription: Molded SOT-223, 6.50 x 3.56 x 1.6mm Body, 4 Lead, 2.3mm Pitch; Supplier 1: Farnell; Supplier Part Number 1: 7614123; PartNumber: LM1117IMP-3.3; RoHS: N; PinCount: 4; Code_JEDEC: TO-261-AA; Code_IPC: SOT223-4; ComponentLink1Description: LM1117 Datasheet; ComponentLink1URL: http://www.national.com/ds/LM/LM1117.pdf; ComponentLink2Description: LM1117 Web Page; ComponentLink2URL: http://www.national.com/pf/LM/LM1117.html; ComponentLink3Description: MP04A Package Page; ComponentLink3URL: http://www.national.com/packaging/folders/mp04a.html
VR2 = RPot: Potentiometer; Published: *; LatestRevisionDate: *; LatestRevisionNote: *; PackageReference: *; Publisher: *; Sim Note: *; Set Position: *; Value: *

## Nets that join several sheets
+LAMP_OUT: Actuator (D7.2 D7A.2 Q7.3 R59.2), ACmonitor (U1.3 U1.4)
+VLAMP: Actuator (K1.1), ACmonitor (U1.1 U1.2)
BAT_LAMP: Actuator (K1.2), ACmonitor (R1.1)
BTGND: Actuator (F1.2 J9.2 LED4.2), ACmonitor (18 pins)
GND: Mcu (28 pins), HUD (10 pins), PLmodule (19 pins), Actuator (9 pins), ACmonitor (7 pins)
PHASE: PLmodule (R47.2), ACmonitor (J6.1)
VA: PLmodule (D2.2 MD1.1), Actuator (Q4.2 Q5.2 R51.2 R52.2)
VCC: Mcu (9 pins), HUD (LCD1.2 LCD1.19 Q1.3 U4.16), PLmodule (C28.2 MD1.29 R45.1 R46.1), ACmonitor (5 pins)
VMAIN: Actuator (J9.1 K1.3 R53.2), ACmonitor (R26.1)
AC SWITCHER: Mcu (U7.42), Actuator (D6.1)
ADC_BAT_LAMP: Mcu (U7.57), ACmonitor (C3.1 R1.2 R2.1)
ADC_ICHARGE1: Mcu (U7.55), ACmonitor (R74.2 U16.1)
ADC_ICHARGE2: Mcu (U7.56), ACmonitor (R78.2 U16.7)
ADC_ILAMP: Mcu (U7.60), ACmonitor (R16.2 U8.1)
ADC_MAIN: Mcu (U7.58), ACmonitor (C9.1 R26.2 R28.1)
ADC_VAC: Mcu (U7.54), ACmonitor (C8.1 R22.1)
ADC_VLAMP: Mcu (U7.59), ACmonitor (C4.1 R3.2 R5.1)
DB0: Mcu (U7.51), HUD (LCD1.7)
DB1: Mcu (U7.50), HUD (LCD1.8)
DB2: Mcu (U7.49), HUD (LCD1.9)
DB3: Mcu (U7.48 U9.5), HUD (LCD1.10)
DB4: Mcu (U7.47 U9.6), HUD (LCD1.11)
DB5: Mcu (U7.46), HUD (LCD1.12)
DB6: Mcu (U7.45), HUD (LCD1.13)
DB7: Mcu (U7.44), HUD (LCD1.14)
E: Mcu (U5.4), HUD (LCD1.6)
IO_8: Mcu (J12.4), PLmodule (MD1.18)
IO_10: Mcu (J12.2), PLmodule (MD1.20)
LCD_CS1: Mcu (U7.31), HUD (LCD1.15)
LCD_CS2: Mcu (U7.30), HUD (LCD1.16)
LCD_RS: Mcu (U7.32), HUD (LCD1.4)
LCD_RST: Mcu (U7.29), HUD (LCD1.17)
PL_SVC-: Mcu (U7.8), PLmodule (MD1.8 R45.2 SW1.1 SW1.3)
SEL_SOURCE: Mcu (U7.7), Actuator (D11.1)
SW_LAMP: Mcu (U7.4), Actuator (R56.1)
SW_SCAN1: Mcu (U7.17), HUD (9 pins)
SW_SCAN2: Mcu (U7.16), HUD (U4.14)
SW_SCAN3: Mcu (U7.15), HUD (U4.15)